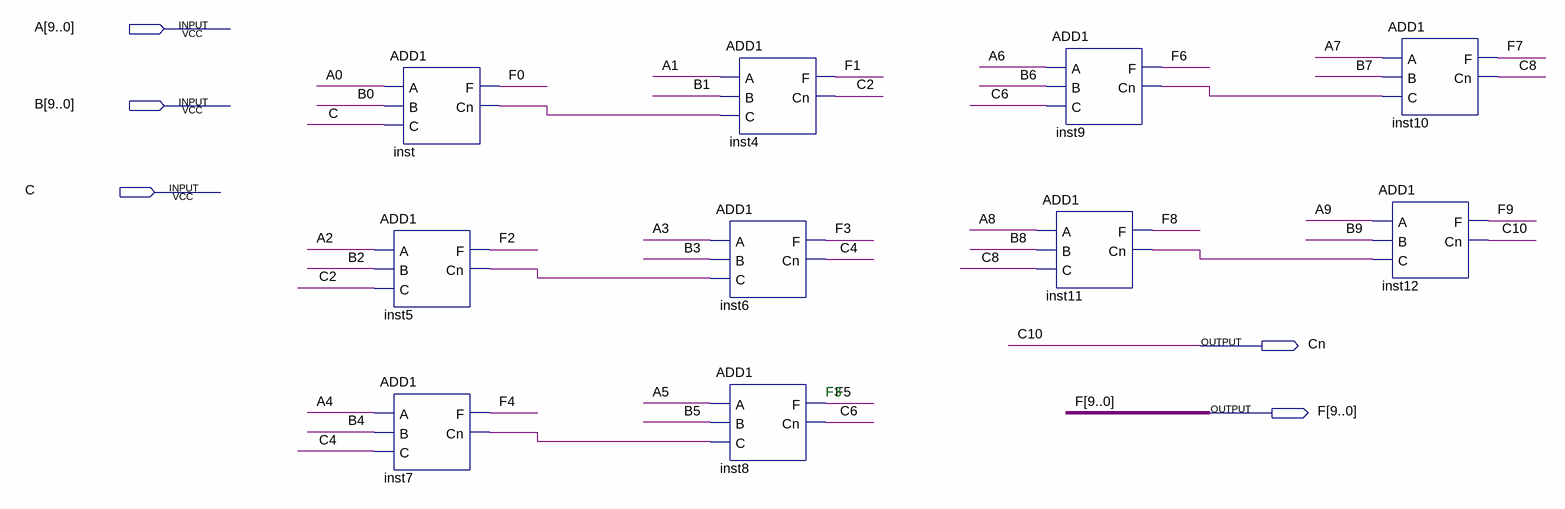
[diagram p0: schematic sheet]
// Quartus schematic ADD10.bdf as structural Verilog: 10 symbols, 5 pins
module ADD10 (
  input  [9:0] A,
  input  [9:0] B,
  input  C,
  output Cn,
  output [9:0] F
);

  wire C2, C4, C6, C8, inst5_cn, inst7_cn, inst9_cn, inst11_cn, inst_cn;

  ADD1 inst (.A(A[0]), .B(B[0]), .C(C), .F(F[0]), .Cn(inst_cn));
  ADD1 inst5 (.A(A[2]), .B(B[2]), .C(C2), .F(F[2]), .Cn(inst5_cn));
  ADD1 inst7 (.A(A[4]), .B(B[4]), .C(C4), .F(F[4]), .Cn(inst7_cn));
  ADD1 inst4 (.A(A[1]), .B(B[1]), .C(inst_cn), .F(F[1]), .Cn(C2));
  ADD1 inst6 (.A(A[3]), .B(B[3]), .C(inst5_cn), .F(F[3]), .Cn(C4));
  ADD1 inst8 (.A(A[5]), .B(B[5]), .C(inst7_cn), .F(F[5]), .Cn(C6));
  ADD1 inst9 (.A(A[6]), .B(B[6]), .C(C6), .F(F[6]), .Cn(inst9_cn));
  ADD1 inst11 (.A(A[8]), .B(B[8]), .C(C8), .F(F[8]), .Cn(inst11_cn));
  ADD1 inst10 (.A(A[7]), .B(B[7]), .C(inst9_cn), .F(F[7]), .Cn(C8));
  ADD1 inst12 (.A(A[9]), .B(B[9]), .C(inst11_cn), .F(F[9]), .Cn(Cn));

  // Other names for the same wires on the sheet: C10 = Cn

  // Notes on the sheet:
  //   F3
endmodule
